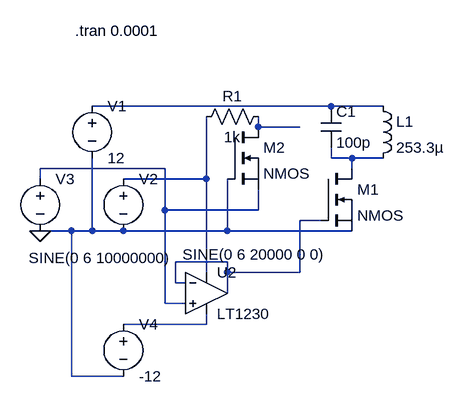
[diagram p0: schematic AMmod.asc]
AMmod.asc, the LTspice schematic file:
Version 4
SHEET 1 880 680
WIRE 384 160 16 160
WIRE 464 160 384 160
WIRE 272 192 272 176
WIRE 336 192 272 192
WIRE 384 240 384 224
WIRE 416 240 384 240
WIRE 464 240 416 240
WIRE 128 256 -64 256
WIRE 416 256 416 240
WIRE -64 272 -64 256
WIRE 192 272 192 176
WIRE 192 272 64 272
WIRE 128 320 128 256
WIRE 272 320 272 288
WIRE 272 320 128 320
WIRE 368 336 336 336
WIRE -16 352 -64 352
WIRE 16 352 16 240
WIRE 16 352 -16 352
WIRE 64 352 16 352
WIRE 224 352 224 272
WIRE 224 352 64 352
WIRE 416 352 224 352
WIRE 224 400 144 400
WIRE 192 416 192 272
WIRE 224 416 224 400
WIRE 336 416 336 336
WIRE 336 416 224 416
WIRE 144 432 144 400
WIRE 160 432 144 432
WIRE 224 448 224 416
WIRE 128 464 128 320
WIRE 160 464 128 464
WIRE 192 496 192 480
WIRE 192 496 64 496
WIRE -16 576 -16 352
WIRE 64 576 -16 576
FLAG -64 352 0
SYMBOL nmos 368 256 R0
SYMATTR InstName M1
SYMBOL ind 448 144 R0
SYMATTR InstName L1
SYMATTR Value 253.3µ
SYMBOL cap 368 160 R0
SYMATTR InstName C1
SYMATTR Value 100p
SYMBOL voltage 16 144 R0
WINDOW 123 0 0 Left 2
WINDOW 39 0 0 Left 2
SYMATTR InstName V1
SYMATTR Value 12
SYMBOL voltage 64 256 R0
WINDOW 3 91 132 Left 2
WINDOW 123 0 0 Left 2
WINDOW 39 0 0 Left 2
SYMATTR InstName V2
SYMATTR Value SINE(0 6 20000 0 0)
SYMBOL voltage -64 256 R0
WINDOW 3 -18 138 Left 2
WINDOW 123 0 0 Left 2
WINDOW 39 0 0 Left 2
SYMATTR InstName V3
SYMATTR Value SINE(0 6 10000000)
SYMBOL Opamps\\LT1230 192 384 R0
SYMATTR InstName U2
SYMBOL nmos 224 192 R0
SYMATTR InstName M2
SYMBOL res 288 160 R90
WINDOW 0 0 56 VBottom 2
WINDOW 3 32 56 VTop 2
SYMATTR InstName R1
SYMATTR Value 1k
SYMBOL voltage 64 480 R0
WINDOW 123 0 0 Left 2
WINDOW 39 0 0 Left 2
SYMATTR InstName V4
SYMATTR Value -12
TEXT -10 44 Left 2 !.tran 0.0001

The netlist it stands for:
* AMmod.asc
M1 N003 N006 0 0 NMOS
L1 N001 N003 253.3µ
C1 N001 N003 100p
V1 N001 0 12
V2 N005 0 SINE(0 6 20000 0 0)
V3 N004 0 SINE(0 6 10000000)
XU2 N004 N006 N005 N007 N006 LT1230  ; pins In+ In- V+ V- OUT
M2 N002 0 N004 N004 NMOS
R1 N002 N005 1k
V4 N007 0 -12
.model NMOS NMOS
.model PMOS PMOS
.lib standard.mos
.tran 0.0001
.backanno
.end